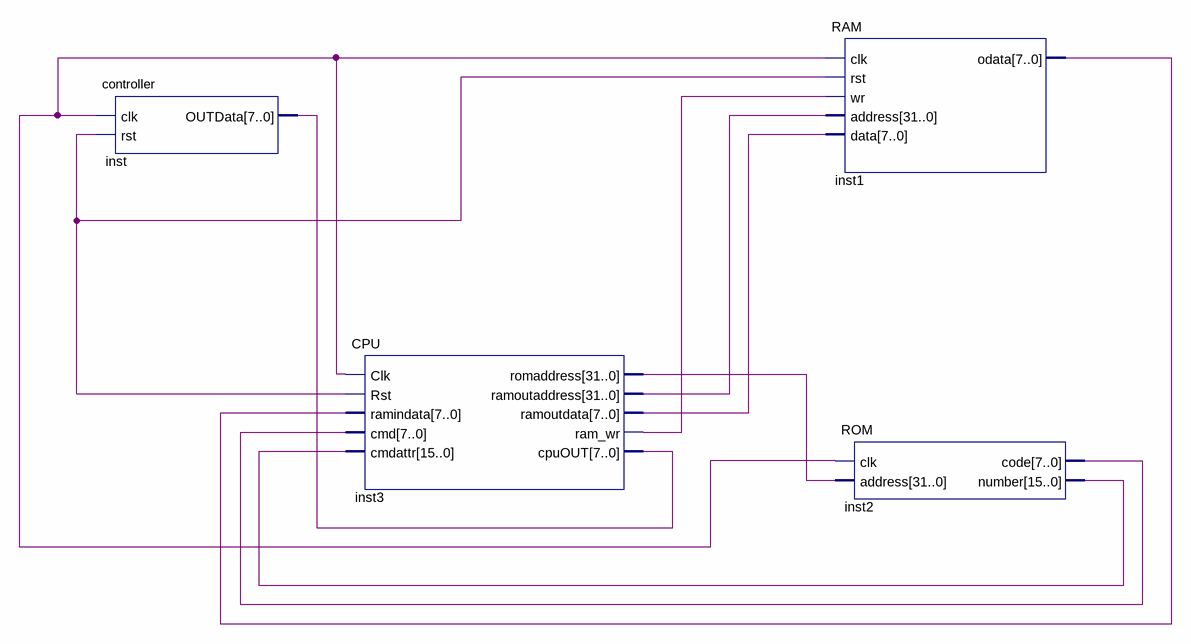
[diagram p0: schematic sheet]
// Quartus schematic MicroComputer.bdf as structural Verilog: 4 symbols, 0 pins
module MicroComputer (
);

  wire inst3_ram_wr, undriven, undriven_2;
  wire [7:0] inst1_odata, inst2_code, inst3_ramoutdata, inst_outdata;
  wire [15:0] inst2_number;
  wire [31:0] inst3_ramoutaddress, inst3_romaddress;

  controller inst (.clk(undriven_2), .rst(undriven), .OUTData(inst_outdata));
  CPU inst3 (
    .Clk(undriven_2), .Rst(undriven), .ramindata(inst1_odata), .cmd(inst2_code), .cmdattr(inst2_number),
    .romaddress(inst3_romaddress), .ramoutaddress(inst3_ramoutaddress), .ramoutdata(inst3_ramoutdata),
    .ram_wr(inst3_ram_wr), .cpuOUT(inst_outdata));
  RAM inst1 (
    .clk(undriven_2), .rst(undriven), .wr(inst3_ram_wr), .address(inst3_ramoutaddress),
    .data(inst3_ramoutdata), .odata(inst1_odata));
  ROM inst2 (.clk(undriven_2), .address(inst3_romaddress), .code(inst2_code), .number(inst2_number));
endmodule
